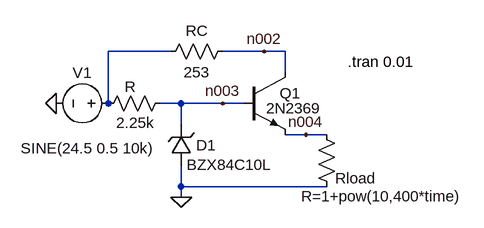
[diagram p0: schematic c02ex07s01.asc]
c02ex07s01.asc, the LTspice schematic file:
Version 4
SHEET 1 1068 680
WIRE 224 64 128 64
WIRE 368 64 304 64
WIRE 400 64 368 64
WIRE 400 96 400 64
WIRE 128 144 128 64
WIRE 240 144 208 144
WIRE 304 144 240 144
WIRE 336 144 304 144
WIRE 240 176 240 144
WIRE 432 192 400 192
WIRE 464 192 432 192
WIRE 240 272 240 240
WIRE 464 272 240 272
WIRE 240 288 240 272
FLAG 48 144 0
FLAG 240 288 0
FLAG 368 64 n002
FLAG 304 144 n003
FLAG 432 192 n004
SYMBOL voltage 144 144 R90
WINDOW 0 -32 56 VBottom 2
WINDOW 3 53 48 VTop 2
WINDOW 123 0 0 Left 0
WINDOW 39 0 0 Left 0
SYMATTR InstName V1
SYMATTR Value SINE(24.5 0.5 10k)
SYMBOL res 224 128 R90
WINDOW 0 6 62 VBottom 2
WINDOW 3 30 54 VTop 2
SYMATTR InstName R
SYMATTR Value 2.25k
SYMBOL res 448 176 R0
WINDOW 0 29 83 Left 2
WINDOW 3 -23 111 Left 2
SYMATTR InstName Rload
SYMATTR Value R=1+pow(10,400*time)
SYMBOL npn 336 96 R0
WINDOW 3 35 55 Left 2
SYMATTR Value 2N2369
SYMATTR InstName Q1
SYMBOL zener 256 240 R180
WINDOW 0 -38 32 Left 2
WINDOW 3 -124 2 Left 2
SYMATTR InstName D1
SYMATTR Value BZX84C10L
SYMBOL res 320 48 R90
WINDOW 0 0 56 VBottom 2
WINDOW 3 32 56 VTop 2
SYMATTR InstName RC
SYMATTR Value 253
TEXT 496 80 Left 2 !.tran 0.01

The netlist it stands for:
* c02ex07s01.asc
V1 N001 0 SINE(24.5 0.5 10k)
R n003 N001 2.25k
Rload n004 0 R=1+pow(10,400*time)
Q1 n002 n003 n004 0 2N2369
D1 0 n003 BZX84C10L
RC n002 N001 253
.model D D
.lib standard.dio
.model NPN NPN
.model PNP PNP
.lib standard.bjt
.tran 0.01
.backanno
.end